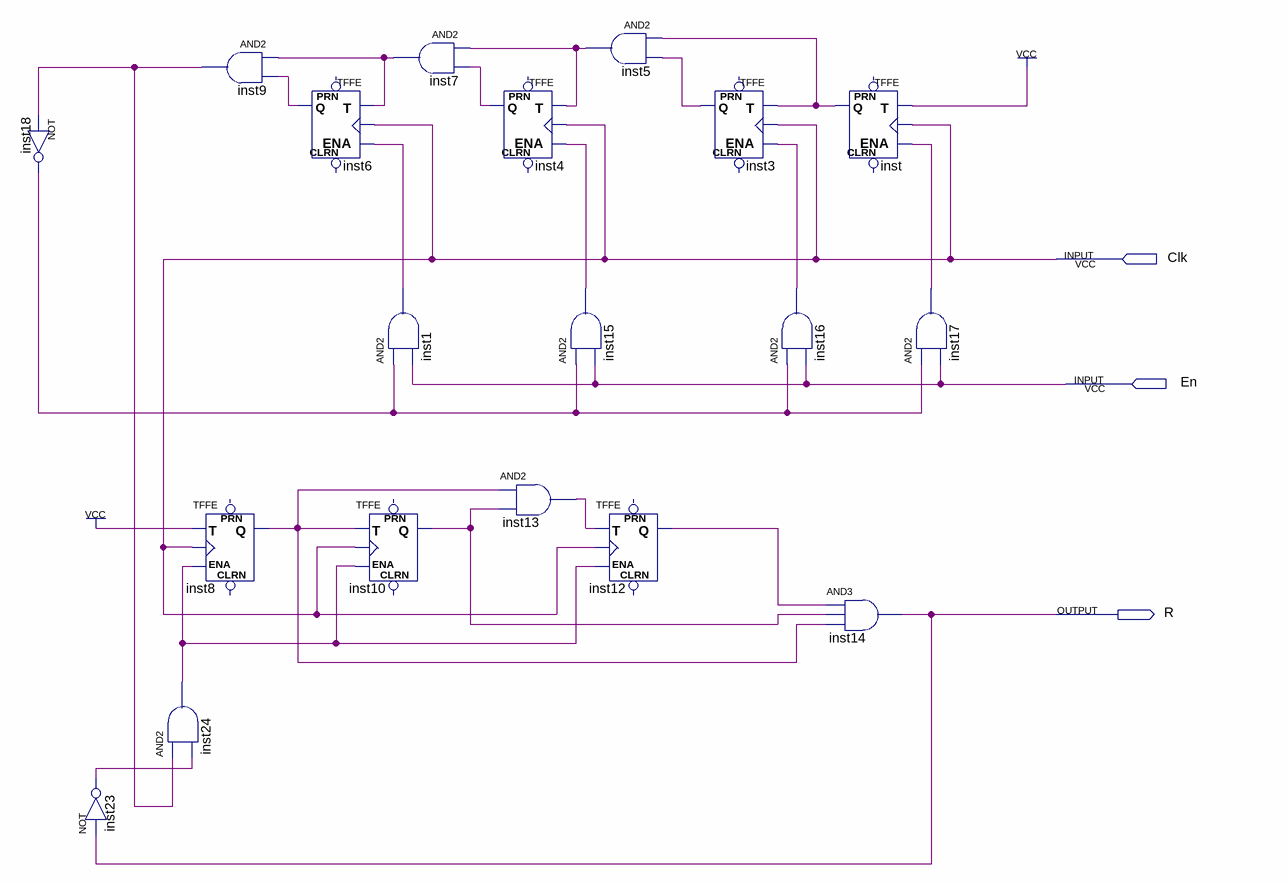
[diagram p0: schematic sheet]
// Quartus schematic 23_counter.bdf as structural Verilog: 19 symbols, 3 pins
module \23_counter  (
  input  Clk,
  input  En,
  output R
);

  wire inst1_out, inst3_q, inst4_q, inst5_out, inst6_q, inst7_out, inst8_q, inst9_out, inst10_q, inst12_q,
       inst13_out, inst15_out, inst16_out, inst17_out, inst18_out, inst23_out, inst24_out, inst_q;

  not inst18 (inst18_out, inst9_out);
  not inst23 (inst23_out, R);
  and inst24 (inst24_out, inst9_out, inst23_out);
  and inst9 (inst9_out, inst7_out, inst6_q);
  TFFE inst8 (.T(1'b1), .CLK(Clk), .ENA(inst24_out), .Q(inst8_q));  // open: CLRN, PRN
  TFFE inst6 (.T(inst7_out), .CLK(Clk), .ENA(inst1_out), .Q(inst6_q));  // open: CLRN, PRN
  and inst7 (inst7_out, inst5_out, inst4_q);
  and inst1 (inst1_out, inst18_out, En);
  TFFE inst10 (.T(inst8_q), .CLK(Clk), .ENA(inst24_out), .Q(inst10_q));  // open: CLRN, PRN
  TFFE inst4 (.T(inst5_out), .CLK(Clk), .ENA(inst15_out), .Q(inst4_q));  // open: CLRN, PRN
  and inst15 (inst15_out, inst18_out, En);
  and inst13 (inst13_out, inst8_q, inst10_q);
  and inst5 (inst5_out, inst_q, inst3_q);
  TFFE inst12 (.T(inst13_out), .CLK(Clk), .ENA(inst24_out), .Q(inst12_q));  // open: CLRN, PRN
  TFFE inst3 (.T(inst_q), .CLK(Clk), .ENA(inst16_out), .Q(inst3_q));  // open: CLRN, PRN
  and inst16 (inst16_out, inst18_out, En);
  TFFE inst (.T(1'b1), .CLK(Clk), .ENA(inst17_out), .Q(inst_q));  // open: CLRN, PRN
  and inst14 (R, inst12_q, inst10_q, inst8_q);
  and inst17 (inst17_out, inst18_out, En);
endmodule
